# Altium schematic sheet POWER.SchDoc
size A3; SheetNumber: 5; SheetTotal: 5
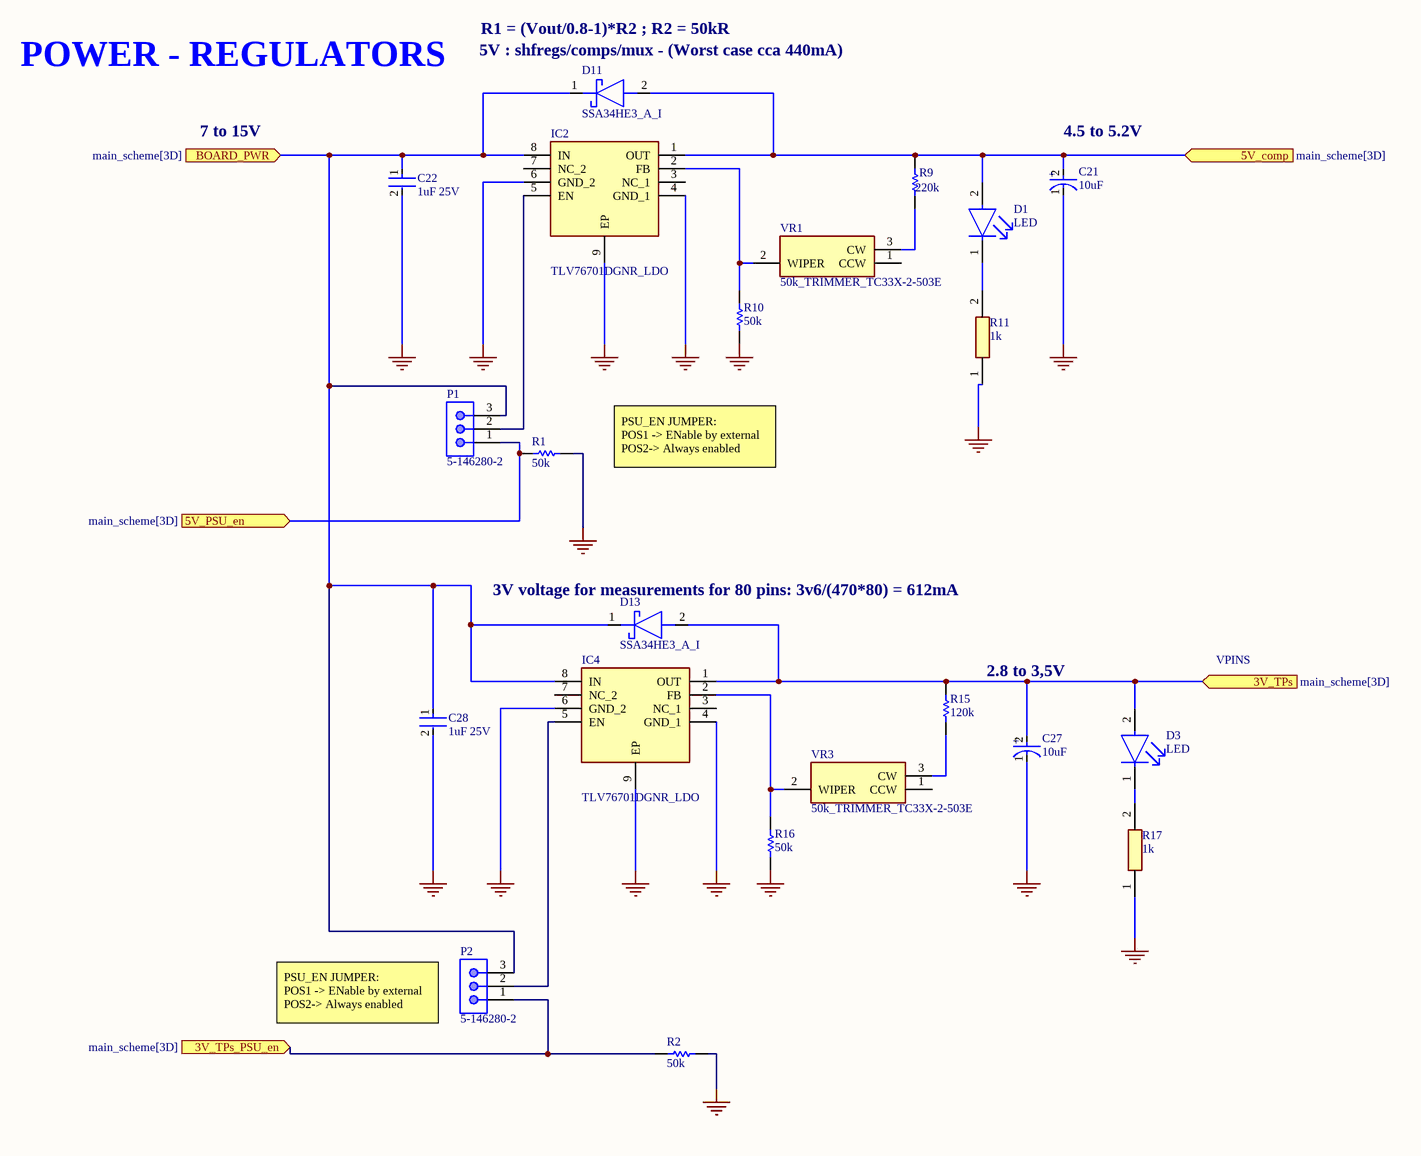
[diagram p0: POWER.SchDoc]

## Parts
C21  10uF  [0603_tantal]
C22  1uF 25V  [0603-CAP]
C27  10uF  [0603_tantal]
C28  1uF 25V  [0603-CAP]
D1  LED  [0603_RED_LED]
D3  LED  [0603_RED_LED]
D11  SSA34HE3_A_I  [DIONM5127X229N]
D13  SSA34HE3_A_I  [DIONM5127X229N]
IC2  TLV76701DGNR_LDO  [SOP65P490X110-9N]
IC4  TLV76701DGNR_LDO  [SOP65P490X110-9N]
P1  5-146280-2  [2.54mm header 3x1]
P2  5-146280-2  [2.54mm header 3x1]
R1  50k  [RESC1005X40X25NL05T05]
R2  50k  [RESC1005X40X25NL05T05]
R9  220k  [RESC1005X40X25NL05T05]
R10  50k  [RESC1005X40X25NL05T05]
R11  1k  [0603- SMD resistor]
R15  120k  [RESC1005X40X25NL05T05]
R16  50k  [RESC1005X40X25NL05T05]
R17  1k  [0603- SMD resistor]
VR1  50k_TRIMMER_TC33X-2-503E  [TC33X2503E]
VR3  50k_TRIMMER_TC33X-2-503E  [TC33X2503E]

## Ports
3V_TPs (in, see main_scheme[3D]), 3V_TPs_PSU_en (in, see main_scheme[3D]), 5V_comp (in, see main_scheme[3D]), 5V_PSU_en (in, see main_scheme[3D]), BOARD_PWR (in, see main_scheme[3D])

## Nets
GND: C21.1(C) C22.2 C27.1(C) C28.2 IC2.4(GND_1) IC2.6(GND_2) IC2.9(EP) IC4.4(GND_1) IC4.6(GND_2) IC4.9(EP) R1.1 R2.1 R10.2 R11.1 R16.2 R17.1
3V_TPs: C27.2(A) D3.2(A) D13.2(A) IC4.1(OUT) R15.1 ; port 3V_TPs
3V_TPs_PSU_en: P2.1 R2.2 ; port 3V_TPs_PSU_en
5V_comp: C21.2(A) D1.2(A) D11.2(A) IC2.1(OUT) R9.1 ; port 5V_comp
5V_PSU_en: P1.1 R1.2 ; port 5V_PSU_en
BOARD_PWR: C22.1 C28.1 D11.1(K) D13.1(K) IC2.8(IN) IC4.8(IN) P1.3 P2.3 ; port BOARD_PWR
NetD1_1: D1.1(C) R11.2
NetD3_1: D3.1(C) R17.2
NetIC2_2: IC2.2(FB) R10.1 VR1.2(WIPER)
NetIC2_5: IC2.5(EN) P1.2
NetIC4_2: IC4.2(FB) R16.1 VR3.2(WIPER)
NetIC4_5: IC4.5(EN) P2.2
NetR9_2: R9.2 VR1.3(CW)
NetR15_2: R15.2 VR3.3(CW)

Not connected (* = marked no-connect by the designer): IC2 3(NC_1) 7(NC_2); IC4 3(NC_1) 7(NC_2); VR1 1(CCW); VR3 1(CCW)

## Notes on the sheet
- POWER - REGULATORS
- (near D11) 5V : shfregs/comps/mux - (Worst case cca 440mA)
- R1 = (Vout/0.8-1)*R2 ; R2 = 50kR
- 7 to 15V
- (near C21) 4.5 to 5.2V
- PSU_EN JUMPER:
  POS1 -> ENable by external
  POS2-> Always enabled
- (near D13) 3V voltage for measurements for 80 pins: 3v6/(470*80) = 612mA
- 2.8 to 3,5V
- VPINS
- (near P2) PSU_EN JUMPER:
  POS1 -> ENable by external
  POS2-> Always enabled
- (in symbol 0603 TantalCAP) +

## Library data of the parts
C21 C27 = 0603 TantalCAP: CAP TANT POLY 10UF 10V SMD; Manufacturer Part Number: F381A106MMAAH1; Manufacturer: AVX; Material: Tantalum-Polymer; Life: 1000Hours; Ripple Current: 289mA; Leakage Current: 10uA; Dissipation Factor: 15%; Esr: 300mΩ; Tolerance: 20%; Category: Cap; ComponentLink2URL: http://datasheets.avx.com/F38.pdf; Automotive: No; Package: F38M; Device Class L2: Capacitors; Octopart: https://octopart.com/f381a106mmaah1-avx-67040376; Device Class L1: Passive Components; Lead Free: Yes; Temperature Range High: +105°C; ComponentLink2Description: Datasheet; Digikey Description: CAP TANT POLY 10UF 10V SMD; Value: 10uF; Temperature Range Low: -55°C; Temperature: -55°C to +105°C; Device Class L3: Polymer Capacitors; Capacitance: 10uF; Height: 0.9mm; Footprint Url: http://www.avx.com/download/software/literature/AVX-Footprint-Library.pdf; RoHS: TRUE; Voltage Rating: 10V; Mouser Description: Cap Tant Polymer 10uF 10VDC M CASE 20% (1.6 X 0.85 X 0.8mm) Undertab SMD 1608-09 0.3 Ohm 105C T/R
C22 C28 = 0603-CAP: General Purpose Ceramic Capacitor, 0603, 1uF, 10%, X5R, 15%, 25V; Tolerance: 20%; Voltage Rating: 6.3V; Voltage Rating (DC): 25V; RoHS Compliant: Yes; Thickness: 0.035inch; Voltage: 25V; Number of Pins: 2; Case Code (Metric): 1608; Dielectric: X5R; Height: 0.9mm; Case Code (Imperial): 0603; Contact Plating: Tin; REACH SVHC: No SVHC; Package Quantity: 1; Case/Package: 0603; Capacitance: 1uF; Lead Free: Lead Free; Series: -; Termination: SMD/SMT; Mount: Surface Mount; Min Operating Temperature: -55°C; Construction: Flat; Packaging: Tape and Reel; Max Operating Temperature: 85°C; Dielectric Material: Ceramic; Length: 1.6mm; Depth: 0.81mm; Radiation Hardening: No; Width: 0.032inch
D1 D3 = 0603_RED_LED_2V2: LED RED DIFFUSED 1608 SMD; Manufacturer: Rohm; Manufacturer Part Number: SML-D12U1WT86; Led Orientation: Top View; Power Dissipation: 54mW; Forward Current: 20mA; Wavelength: 620nm; Reverse Voltage: 5V; Luminous Intensity: 63mcd; Forward Voltage: 2.2V; Mouser Description: SML-D12 Series Red 0603 Diffused 63 mcd 2.2 V Surface Mount LED; Temperature: -40°C to +85°C; Device Class L2: LEDs; Lead Free: Yes; Automotive: No; Octopart: https://octopart.com/sml-d12u1wt86-rohm-70850259; RoHS: TRUE; Colour: Red; Digikey Description: LED RED DIFFUSED 1608 SMD; Package: SML-D12; Device Class L1: Optoelectronics; Category: Diode; Temperature Range High: +85°C; Height: 0.65mm; ComponentLink2Description: Datasheet; Temperature Range Low: -40°C; ComponentLink2URL: https://www.rohm.com/datasheet/SML-D12U1W/sml-d12x1-e; Device Class L3: unset
D11 D13 = SSA34HE3_A_I: Schottky Diode; Manufacturer_Name: Vishay; Manufacturer_Part_Number: SSA34HE3_A/I; Datasheet Link: https://componentsearchengine.com/Datasheets/1/SSA34HE3_A_I.pdf; Height: 2.29mm; Mouser Part Number: 78-SSA34HE3_A/I; Mouser Price/Stock: https://www.mouser.co.uk/ProductDetail/Vishay-General-Semiconductor/SSA34HE3_A-I?qs=asPD7ZL2j3VimMFbwwU%2FoA%3D%3D; Arrow Part Number: SSA34HE3_A/I; Arrow Price/Stock: https://www.arrow.com/en/products/ssa34he3-ai/vishay?region=nac
IC2 IC4 = TLV76701DGNR_LDO: Integrated Circuit; Manufacturer_Name: Texas Instruments; Datasheet Link: https://www.ti.com/lit/ds/symlink/tlv767.pdf?ts=1634721803014&ref_url=https%253A%252F%252Fwww.ti.com%252Fproduct%252FTLV767; Height: 1.1mm; Manufacturer_Part_Number: TLV76701DGNR
P1 P2 = 3x1 Header: Male Header, Pitch 2.54 mm, 1 x 2 Position, Height 8.21 mm, Tail Length 3.05 mm, -65 to 105 degC, RoHS, Bulk; Manufacturer: TE Connectivity; Mating Connector Lock: No(Without); Number of Positions: 2; Pitch: 2.54mm; PCB Mounting Orientation: Vertical; Keyed: No; Case\/Package: 100; Mating Post Length: 0.23inch; High Temperature Housing: Yes; Max Current Rating: 5A; PCB Thickness: 0.063inch; PCB Mount Retention: Without; Approvals: CSA; Current Rating: 3A; Radiation Hardening: No; Length: 4.67mm; Contact Mating Length: 0.23inch; Connector Type: Header; Number of Rows: 1; Termination Post Length: 0.12inch; Board Standoff: No(Without); Max Operating Temperature: 105degC; Contact Shape: Square; Selectively Loaded: No(Without); Gasket: No(Without); Number of Contacts: 2; Contact Gender: Male; Mating Alignment: No(Without); Manufacturer URL: http://www.te.com/; Datasheet URL: http://www.te.com/commerce/DocumentDelivery/DDEController?Action=showdoc&DocId=Customer+Drawing%7F146280%7FH1%7Fpdf%7FEnglish%7FENG_CD_146280_H1.pdf%7F5-146280-2; Mount: ThroughHole; Orientation: Straight; Packaging: Carton; Package Reference: 5-146280-2; Package Quantity: 500; Stabilizers: No(Without); Row Spacing: 2.54mm; Contact Material: CopperAlloy; Panel Mount Retention: No(Without); Datasheet Version: Rev. H1, 08/2016; Housing Colour: Black; Colour: Black; Package Description: Male Header, Pitch 2.54 mm, 1 x 2 Position, Height 8.21 mm, Tail Length 3.05 mm; Contact Plating: Matte; Housing Material: Polymer; Contact Protection: No(Without); Min Operating Temperature: -65degC; Mounting Technology: ThroughHole; Flammability Rating: UL94V-0; RoHSCompliant: true; Termination: ThroughHole; Depth: 2.34mm; High Speed Serial Data Connector: No
R1 R2 R9 R10 R15 R16 = Resistor 0402 100mW: Part Number: ERJ2RKF6800X; Manufacturer: Panasonic
R11 R17 = 0603 - SMD RESISTOR: Resistor; Manufacturer_Name: Bourns; Manufacturer_Part_Number: CR0603-J/-9R1ELF; Datasheet Link: https://www.bourns.com/pdfs/chpreztr.pdf; Height: 0.55mm; Mouser Part Number: 652-CR0603-J/-9R1ELF; Mouser Price/Stock: https://www.mouser.com/Search/Refine.aspx?Keyword=652-CR0603-J%2F-9R1ELF
VR1 VR3 = 50k_TRIMMER_TC33X-2-503E: Variable Resistor; Manufacturer_Name: Bourns; Datasheet Link: https://componentsearchengine.com/Datasheets/1/TC33X-2-503E.pdf; Height: 1.2mm; Manufacturer_Part_Number: TC33X-2-503E; Mouser Part Number: 652-TC33X-2-503E; Mouser Price/Stock: https://www.mouser.co.uk/ProductDetail/Bourns/TC33X-2-503E?qs=tEaODSGlU8NgxHjveDtEEg%3D%3D; Arrow Part Number: TC33X-2-503E; Arrow Price/Stock: https://www.arrow.com/en/products/tc33x-2-503e/bourns?region=nac